# EAGLE schematic canusb (EAGLE 7.2.0)
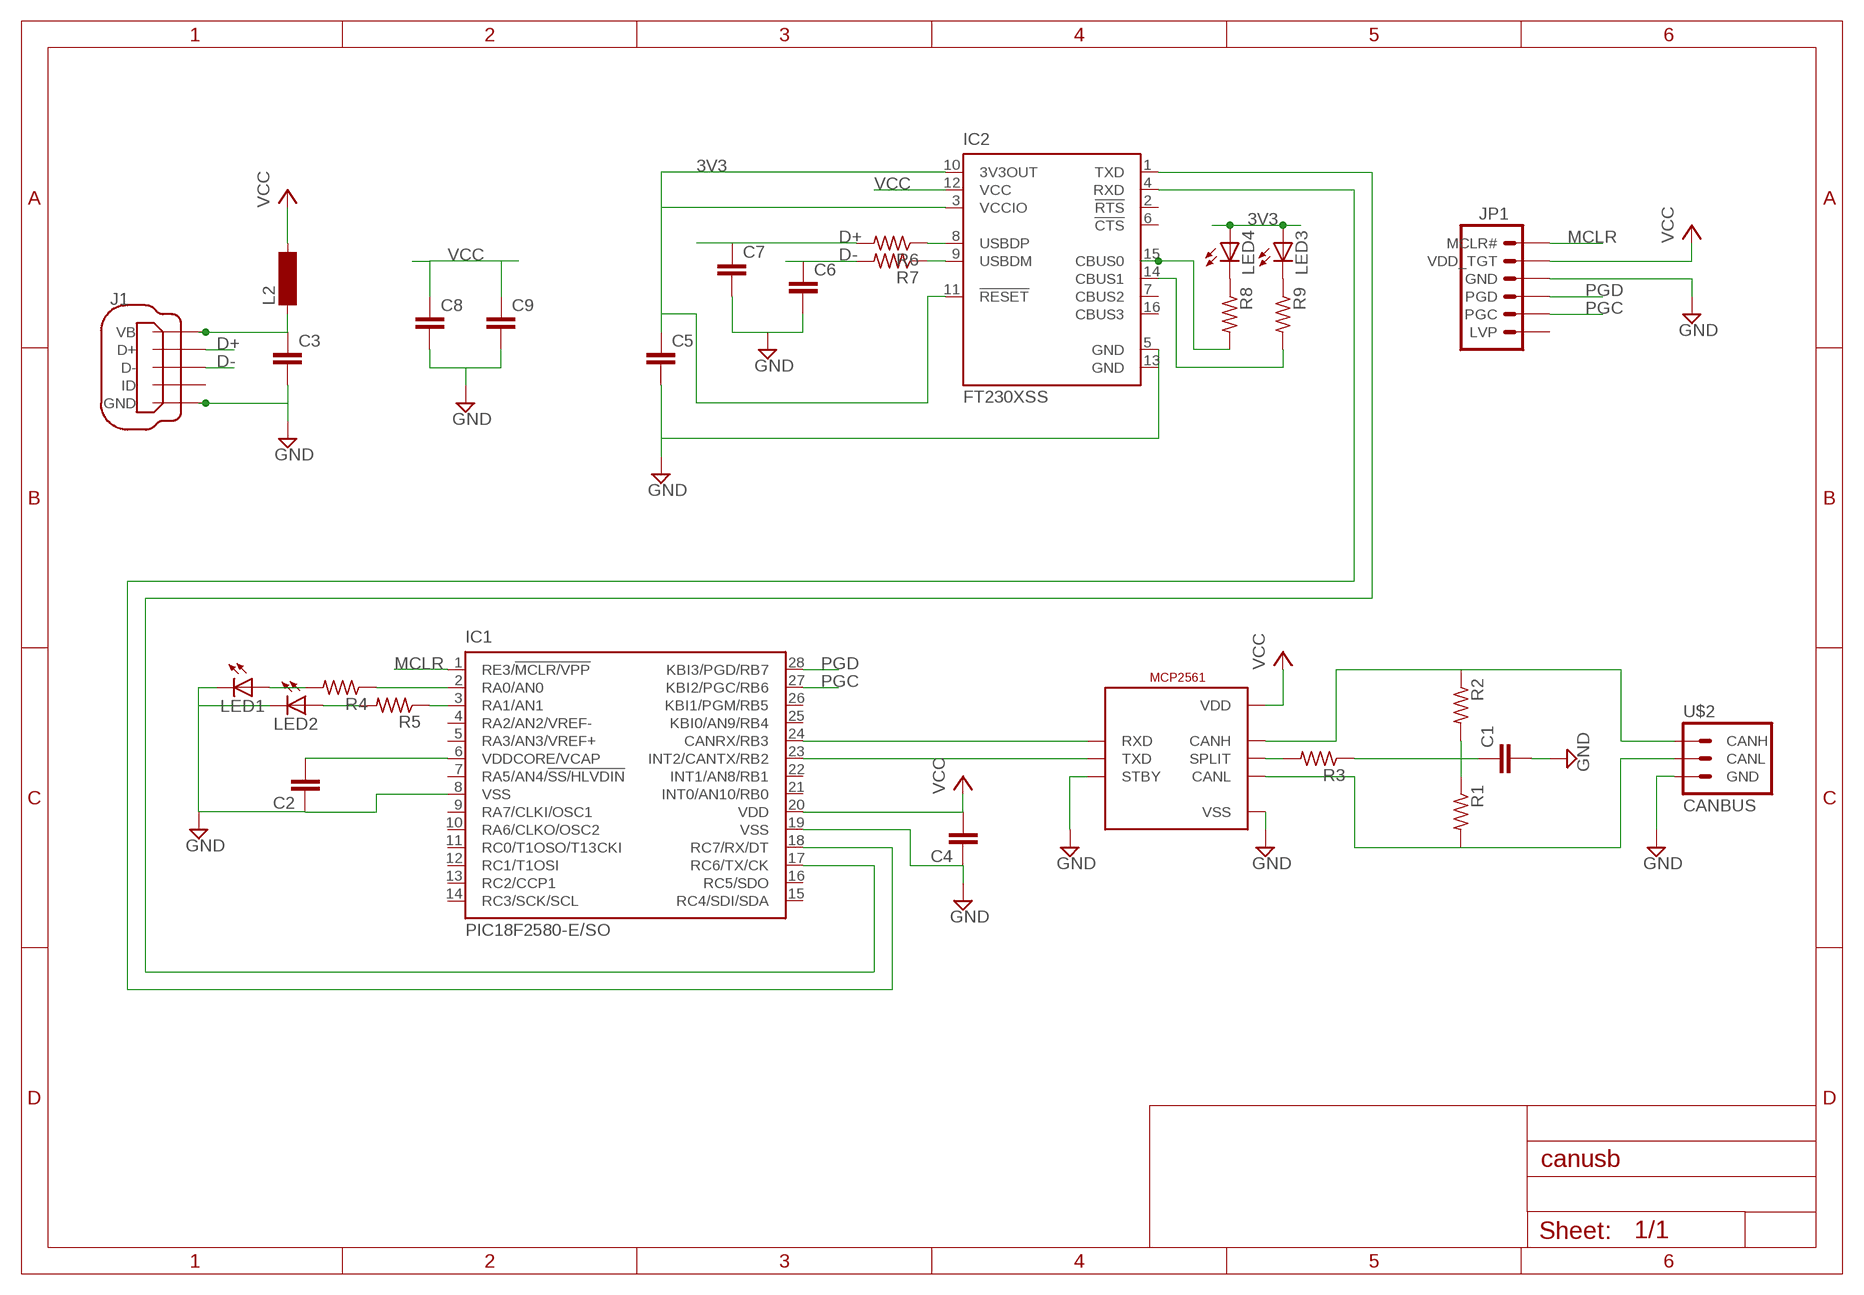
[diagram p0: schematic, sheet 1]

## Parts
C1  C-EUC0805K  [C0805K]
C2  C-EUC0805K  [C0805K]
C3  C-EUC0805K  [C0805K]
C4  C-EUC0805K  [C0805K]
C5  C-EUC0805K  [C0805K]
C6  C-EUC0805K  [C0805K]
C7  C-EUC0805K  [C0805K]
C8  C-EUC0805K  [C0805K]
C9  C-EUC0805K  [C0805K]
IC1  PIC18F2580-E/SO  [SO28W]
IC2  FT230XSS  [SSOP16]
J1  J_USB_MICROAB_HIROSE_ZX62-AB-5PA  [J_USB_MICROAB_HIROSE_ZX62-AB-5PA]
JP1  ICSPLOCK  [1X06_LOCK]
L2  FERRITE_BEAD  [R0805]
LED1  LEDCHIPLED_0805  [CHIPLED_0805]
LED2  LEDCHIPLED_0805  [CHIPLED_0805]
LED3  LEDCHIPLED_0805  [CHIPLED_0805]
LED4  LEDCHIPLED_0805  [CHIPLED_0805]
R1  R-US_M0805  [M0805]
R2  R-US_M0805  [M0805]
R3  R-US_M0805  [M0805]
R4  R-US_M0805  [M0805]
R5  R-US_M0805  [M0805]
R6  R-US_M0805  [M0805]
R7  R-US_M0805  [M0805]
R8  R-US_M0805  [M0805]
R9  R-US_M0805  [M0805]
U$1  MCP2561  [SOIC8]
U$2  CANBUS  [MA03-1]

## Nets
3V3: C5.1 IC2.3(VCCIO) IC2.10(3V3OUT) IC2.11(!RESET) LED3.A LED4.A
D+: C7.1 J1.P$3(D+) R6.2
D-: C6.1 J1.P$2(D-) R7.2
GND: C1.2 C2.1 C3.2 C4.1 C5.2 C6.2 C7.2 C8.2 C9.2 IC1.8(VSS) IC1.19(VSS) IC2.5(GND) IC2.13(GND) J1.P$5(GND) JP1.3(GND) LED1.C LED2.C U$1.P$2(VSS) U$1.P$8(STBY) U$2.3(GND)
MCLR: IC1.1(RE3/!MCLR/VPP) JP1.1(MCLR#)
N$1: R3.2 U$1.P$5(SPLIT)
N$2: R1.2 U$1.P$6(CANL) U$2.2(CANL)
N$3: R2.1 U$1.P$7(CANH) U$2.1(CANH)
N$4: C1.1 R1.1 R2.2 R3.1
N$5: IC1.18(RC7/RX/DT) IC2.4(RXD)
N$6: IC1.24(CANRX/RB3) U$1.P$4(RXD)
N$7: IC1.23(INT2/CANTX/RB2) U$1.P$1(TXD)
N$9: C3.1 J1.P$1(VB) L2.1
N$10: IC1.2(RA0/AN0) R4.1
N$11: IC1.3(RA1/AN1) R5.1
N$12: LED1.A R4.2
N$13: LED2.A R5.2
N$14: C2.2 IC1.6(VDDCORE/VCAP)
N$15: IC1.17(RC6/TX/CK) IC2.1(TXD)
N$17: IC2.8(USBDP) R6.1
N$18: IC2.9(USBDM) R7.1
N$20: LED4.C R8.1
N$21: LED3.C R9.1
N$22: IC2.15(CBUS0) R8.2
N$23: IC2.14(CBUS1) R9.2
PGC: IC1.27(KBI2/PGC/RB6) JP1.5(PGC)
PGD: IC1.28(KBI3/PGD/RB7) JP1.4(PGD)
VCC: C4.2 C8.1 C9.1 IC1.20(VDD) IC2.12(VCC) JP1.2(VDD_TGT) L2.2 U$1.P$3(VDD)
Unconnected: IC1.4(RA2/AN2/VREF-) IC1.5(RA3/AN3/VREF+) IC1.7(RA5/AN4/!SS/HLVDIN) IC1.9(RA7/CLKI/OSC1) IC1.10(RA6/CLKO/OSC2) IC1.11(RC0/T1OSO/T13CKI) IC1.12(RC1/T1OSI) IC1.13(RC2/CCP1) IC1.14(RC3/SCK/SCL) IC1.15(RC4/SDI/SDA) IC1.16(RC5/SDO) IC1.21(INT0/AN10/RB0) IC1.22(INT1/AN8/RB1) IC1.25(KBI0/AN9/RB4) IC1.26(KBI1/PGM/RB5) IC2.2(!RTS) IC2.6(!CTS) IC2.7(CBUS2) IC2.16(CBUS3) J1.P$4(ID) JP1.6(LVP)

## Library data of the parts
C1-C9 = rcl:C-EU: CAPACITOR, European symbol
IC1 = Canaconda:PIC18F2*80: 28-Pin Enhanced Flash Microcontrollers with ECAN(TM) Technology 10-Bit A/D and nanoWatt Technology Source: http://www.microchip.com .. 39637a.pdf; MF: MICROCHIP; MPN: PIC18F2580-I/SO; OC_FARNELL: 9321284; OC_NEWARK: 71J7243
IC2 = Canaconda:FT230XS: USB to BASIC UART IC Auto generated by make-symbol-device-package-bsdl.ulp Rev. 43 Source: Data sheet <http://www.ftdichip.com/Support/Documents/DataSheets/ICs/DS_FT230X.pdf>
J1 = Canaconda:J_USB_MICROAB_HIROSE_ZX62-AB-5PA: USB Micro-AB SMT connector Hirose Electric Co Ltd: ZX62-AB-5P
JP1 = Canaconda:ICSP
L2 = Canaconda:FERRITE_BEAD: INDUCTOR nominal inductance, magnetically screened
LED1-LED4 = led:LED: LED OSRAM: - CHIPLED LG R971, LG N971, LY N971, LG Q971, LY Q971, LO R971, LY R971 LH N974, LH R974 LS Q976, LO Q976, LY Q976 LO Q996 - Hyper CHIPLED LW Q18S LB Q993, LB Q99A, LB R99A - SideLED LS A670, LO A670, LY A670, LG A670, LP A670 LB A673, LV A673, LT A673, LW A673 LH A674 LY A675 LS A676, LA A676, LO A676, LY A676, LW A676 LS A679, LY A679, LG A679 - Hyper Micro SIDELED® LS Y876, LA Y876, LO Y876, LY Y876 LT Y87S - SmartLED LW L88C, LW L88S LB L89C, LB L89S, LG L890 LS L89K, LO L89K, LY L89K LS L896, LA L896, LO L896, LY L896 - TOPLED LS T670, LO T670, LY T670, LG T670, LP T670 LSG T670, LSP T670, LSY T670, LOP T670, LYG T670 LG T671, LOG T671, LSG T671 LB T673, LV T673, LT T673, LW T673 LH T674 LS T676, LA T676, LO T676, LY T676, LB T676, LH T676, LSB T676, LW T676 LB T67C, LV T67C, LT T67C, LS T67K, LO T67K, LY T67K, LW E67C LS E67B, LA E67B, LO E67B, LY E67B, LB E67C, LV E67C, LT E67C LW T67C LS T679, LY T679, LG T679 LS T770, LO T770, LY T770, LG T770, LP T770 LB T773, LV T773, LT T773, LW T773 LH T774 LS E675, LA E675, LY E675, LS T675 LS T776, LA T776, LO T776, LY T776, LB T776 LHGB T686 LT T68C, LB T68C - Hyper Mini TOPLED® LB M676 - Mini TOPLED Santana® LG M470 LS M47K, LO M47K, LY M47K Source: http://www.osram.convergy.de LUXEON: - LUMILED® LXK2-PW12-R00, LXK2-PW12-S00, LXK2-PW14-U00, LXK2-PW14-V00 LXK2-PM12-R00, LXK2-PM12-S00, LXK2-PM14-U00 LXK2-PE12-Q00, LXK2-PE12-R00, LXK2-PE12-S00, LXK2-PE14-T00, LXK2-PE14-U00 LXK2-PB12-K00, LXK2-PB12-L00, LXK2-PB12-M00, LXK2-PB14-N00, LXK2-PB14-P00, LXK2-PB14-Q00 LXK2-PR12-L00, LXK2-PR12-M00, LXK2-PR14-Q00, LXK2-PR14-R00 LXK2-PD12-Q00, LXK2-PD12-R00, LXK2-PD12-S00 LXK2-PH12-R00, LXK2-PH12-S00 LXK2-PL12-P00, LXK2-PL12-Q00, LXK2-PL12-R00 Source: www.luxeon.com KINGBRIGHT: KA-3528ASYC Source: www.kingbright.com
R1-R9 = rcl:R-US_: RESISTOR, American symbol
U$1 = Canaconda:MCP2561
U$2 = Canaconda:CANBUS